# EAGLE design batteryholder2S3P (EAGLE 9.5.1)
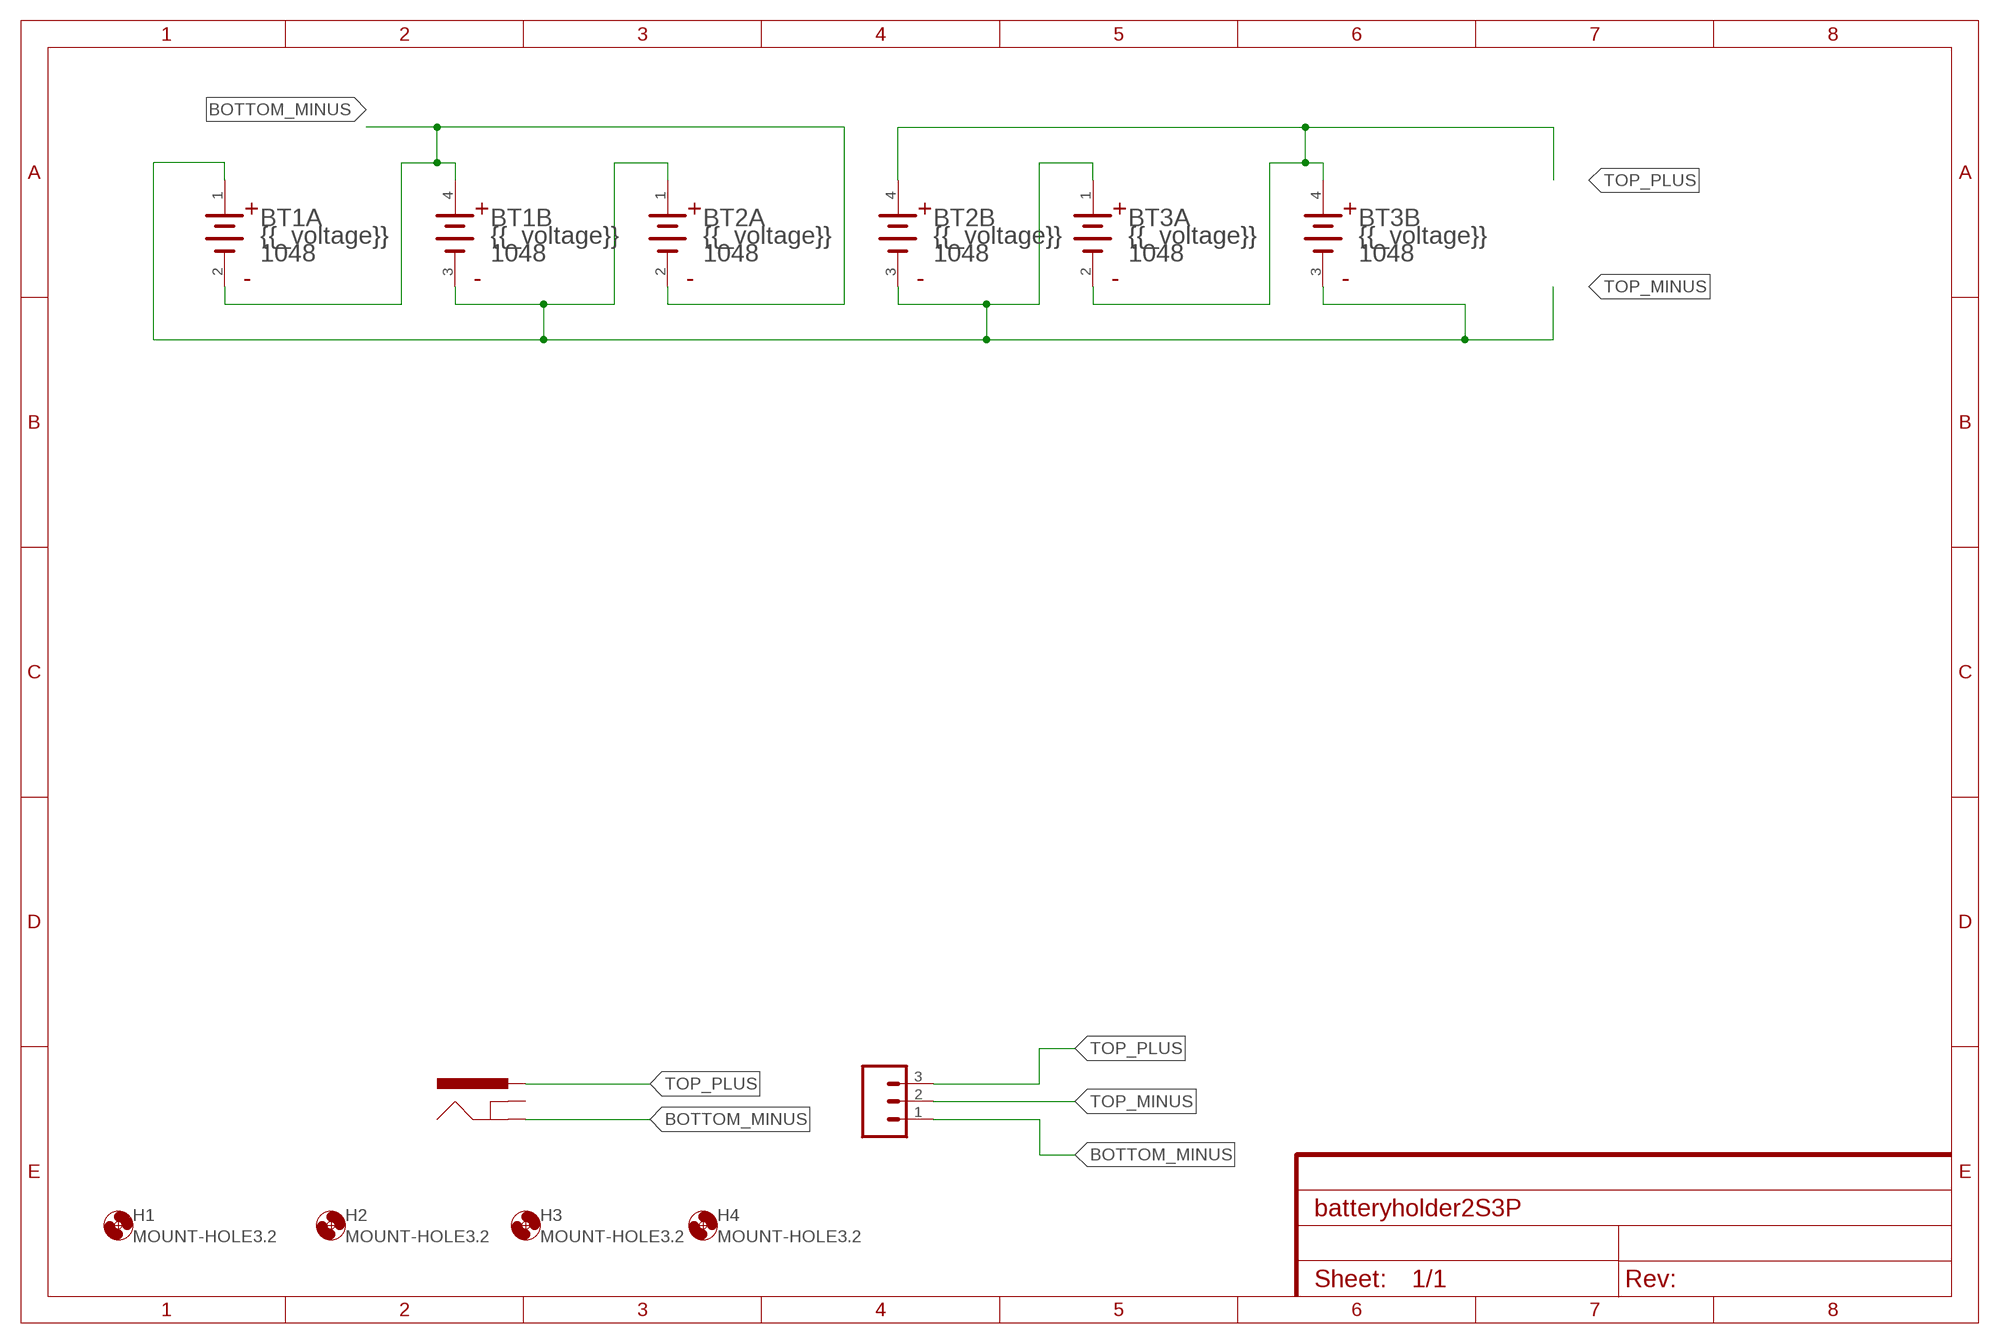
[diagram p0: schematic, sheet 1]

## Parts
BT1  KEYSTONE_1048KEYSTONE_1048_0_0  [KEYSTONE_1048_0]
BT2  KEYSTONE_1048KEYSTONE_1048_0_0  [KEYSTONE_1048_0]
BT3  KEYSTONE_1048KEYSTONE_1048_0_0  [KEYSTONE_1048_0]
H1  MOUNT-HOLE3.2  [3,2]
H2  MOUNT-HOLE3.2  [3,2]
H3  MOUNT-HOLE3.2  [3,2]
H4  MOUNT-HOLE3.2  [3,2]
J1  CONN_03-SCREW-5MM  [SCREWTERMINAL-5MM-3]
J3  5.5x2.1mm Barrel  POWER_JACKSMD  [POWER_JACK_SMD]

## Nets
BOTTOM_MINUS: BT1.2(A:1_CATHODE) BT1.4(B:2_ANODE) BT2.2(A:1_CATHODE) J1.1 J3.P$4(GND)
TOP_MINUS: BT1.1(A:1_ANODE) BT1.3(B:2_CATHODE) BT2.1(A:1_ANODE) BT2.3(B:2_CATHODE) BT3.1(A:1_ANODE) BT3.3(B:2_CATHODE) J1.2
TOP_PLUS: BT2.4(B:2_ANODE) BT3.2(A:1_CATHODE) BT3.4(B:2_ANODE) J1.3 J3.VIN0(PWR)
Unconnected: J3.GND(GNDBREAK)

## Library data of the parts
BT1-BT3 = Keystone - 1048:KEYSTONE_1048: SMT Holder for Dual 18650 Batteries; CENTROID_NOT_SPECIFIED: No; CONN_ORIENTATION: Horizontal; CONTACT_MATERIAL: Gold,Nickel; DATASHEET: https://www.keyelco.com/userAssets/file/M65p27.pdf; DEVICE_CLASS_L1: Connectors; DEVICE_CLASS_L2: unset; DEVICE_CLASS_L3: unset; DIGIKEY_DESCRIPTION: BATT HOLDER 18650 2 CELL SMD TAB; DIGIKEY_PART_NUMBER: 36-1048-ND; FOOTPRINT_URL: https://www.keyelco.com/product-pdf.cfm?p=920; HEIGHT: 0.595inch; LEAD_FREE: yes; MF: Keystone; MFG_PACKAGE_IDENT: 1048; MFG_PACKAGE_IDENT_DATE: 0; MFG_PACKAGE_IDENT_REV: 0; MOUSER_DESCRIPTION: Battery holder SMD Dimensions L x W x H: 86 x 39.78 x 14.86 mm Suitable for: 2 x 18650; MOUSER_PART_NUMBER: 534-1048; MPN: 1048; NUMBER_OF_CONTACTS: 2; PACKAGE: SMT_BTTHLDR_18650_DUAL; PREFIX: BT; ROHS: yes; TEMPERATURE_RANGE_HIGH: +145°C; TEMPERATURE_RANGE_LOW: -50°C; VERIFICATION_VERSION: 0.0.0.1
H1-H4 = holes:MOUNT-HOLE: MOUNTING HOLE with drill center marker
J1 = SparkFun-Connectors:CONN_03: Multi connection point. Often used as Generic Header-pin footprint for 0.1 inch spaced/style header connections On any of the 0.1 inch spaced packages, you can populate with these: Break Away Headers - Straight <https://www.sparkfun.com/products/116> (PRT-00116) Break Away Male Headers - Right Angle <https://www.sparkfun.com/products/553> (PRT-00553) Female Headers <https://www.sparkfun.com/products/115> (PRT-00115) Break Away Headers - Machine Pin <https://www.sparkfun.com/products/117> (PRT-00117) Break Away Female Headers - Swiss Machine Pin <https://www.sparkfun.com/products/743> (PRT-00743) Stackable Header - 3 Pin (Female, 0.1") <https://www.sparkfun.com/products/13875> (PRT-13875) For SCREWTERMINALS and SPRING TERMINALS visit here: Screw Terimnals on SparkFun.com <https://www.sparkfun.com/search/results?term=Screw+Terminals> (5mm/3.5mm/2.54mm spacing) This device is also useful as a general connection point to wire up your design to another part of your project. Our various solder wires solder well into these plated through hole pads. Hook-Up Wire - Assortment (Stranded, 22 AWG) <https://www.sparkfun.com/products/11375> (PRT-11375) Hook-Up Wire - Assortment (Solid Core, 22 AWG) <https://www.sparkfun.com/products/11367> (PRT-11367) View the entire wire category on our website here <https://www.sparkfun.com/categories/141> Special notes: Molex polarized connector foot print use with SKU : PRT-08232 with associated crimp pins and housings.; PROD_ID: CONN-10134; SF_SKU: PRT-08433
J3 = SparkFun-Connectors:POWER_JACK: Power Jack Connector This is the standard 5.5mm barrel jack for power. The PTH is the most common, proven, reliable, footprint. The Slot footprint only works if the mill layer is transmitted to the PCB fab house so be warned. Here are the connectors we sell at SparkFun: DC Barrel Power Jack/Connector <https://www.sparkfun.com/products/119> (PRT-00119) DC Barrel Power Jack/Connector (SMD) <https://www.sparkfun.com/products/12748> (PRT-12748) DC Barrel Jack Adapter - Breadboard Compatible <https://www.sparkfun.com/products/10811> (PRT-10811) It is used on this SparkFun product (and many, many others): SparkFun RedBoard - Programmed with Arduino <https://www.sparkfun.com/products/12757> (DEV-12757) Also, if you need a mating power supply or connector, please check these out: Wall Adapter Power Supply - 9VDC 650mA <https://www.sparkfun.com/products/298> (TOL-00298) DC Barrel Jack Adapter - Male <https://www.sparkfun.com/products/10287> (PRT-10287); PROD_ID: CONN-08106; SF_ID: PRT-12748

## Board
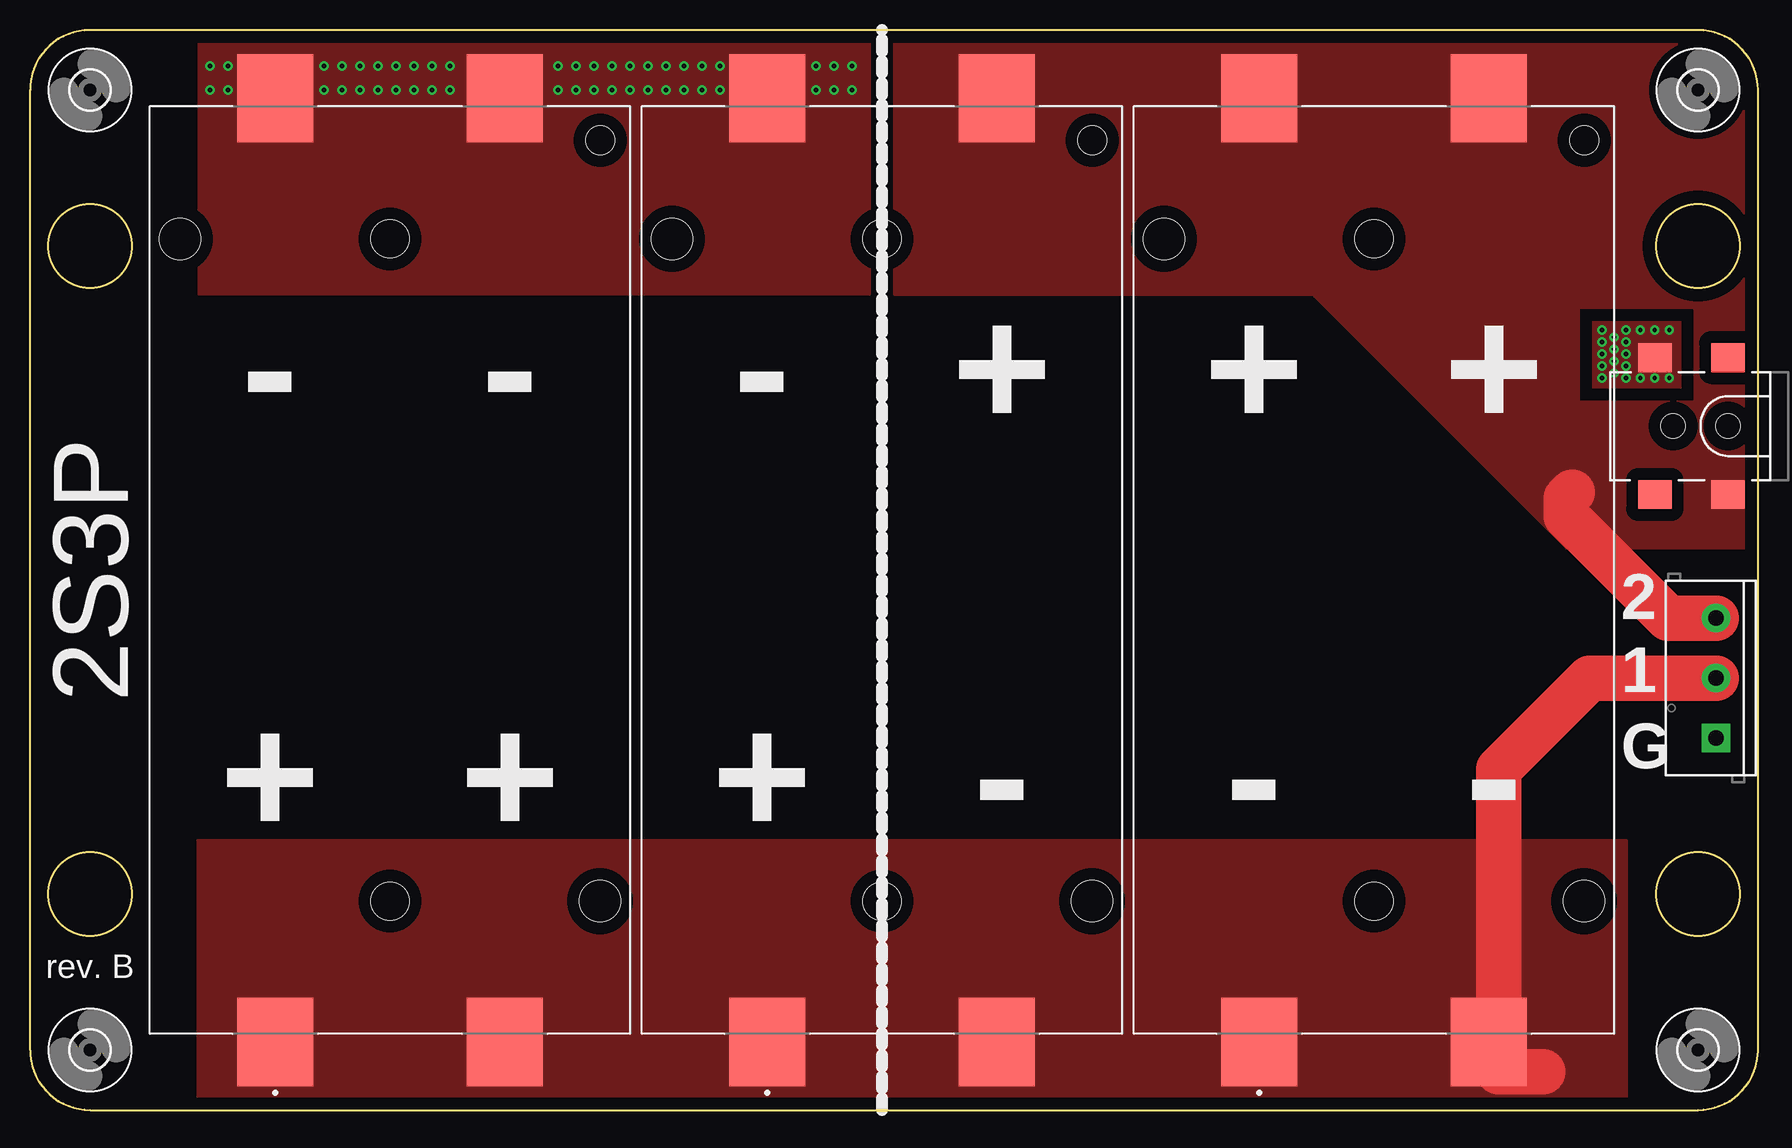
[diagram p1: board, top side]
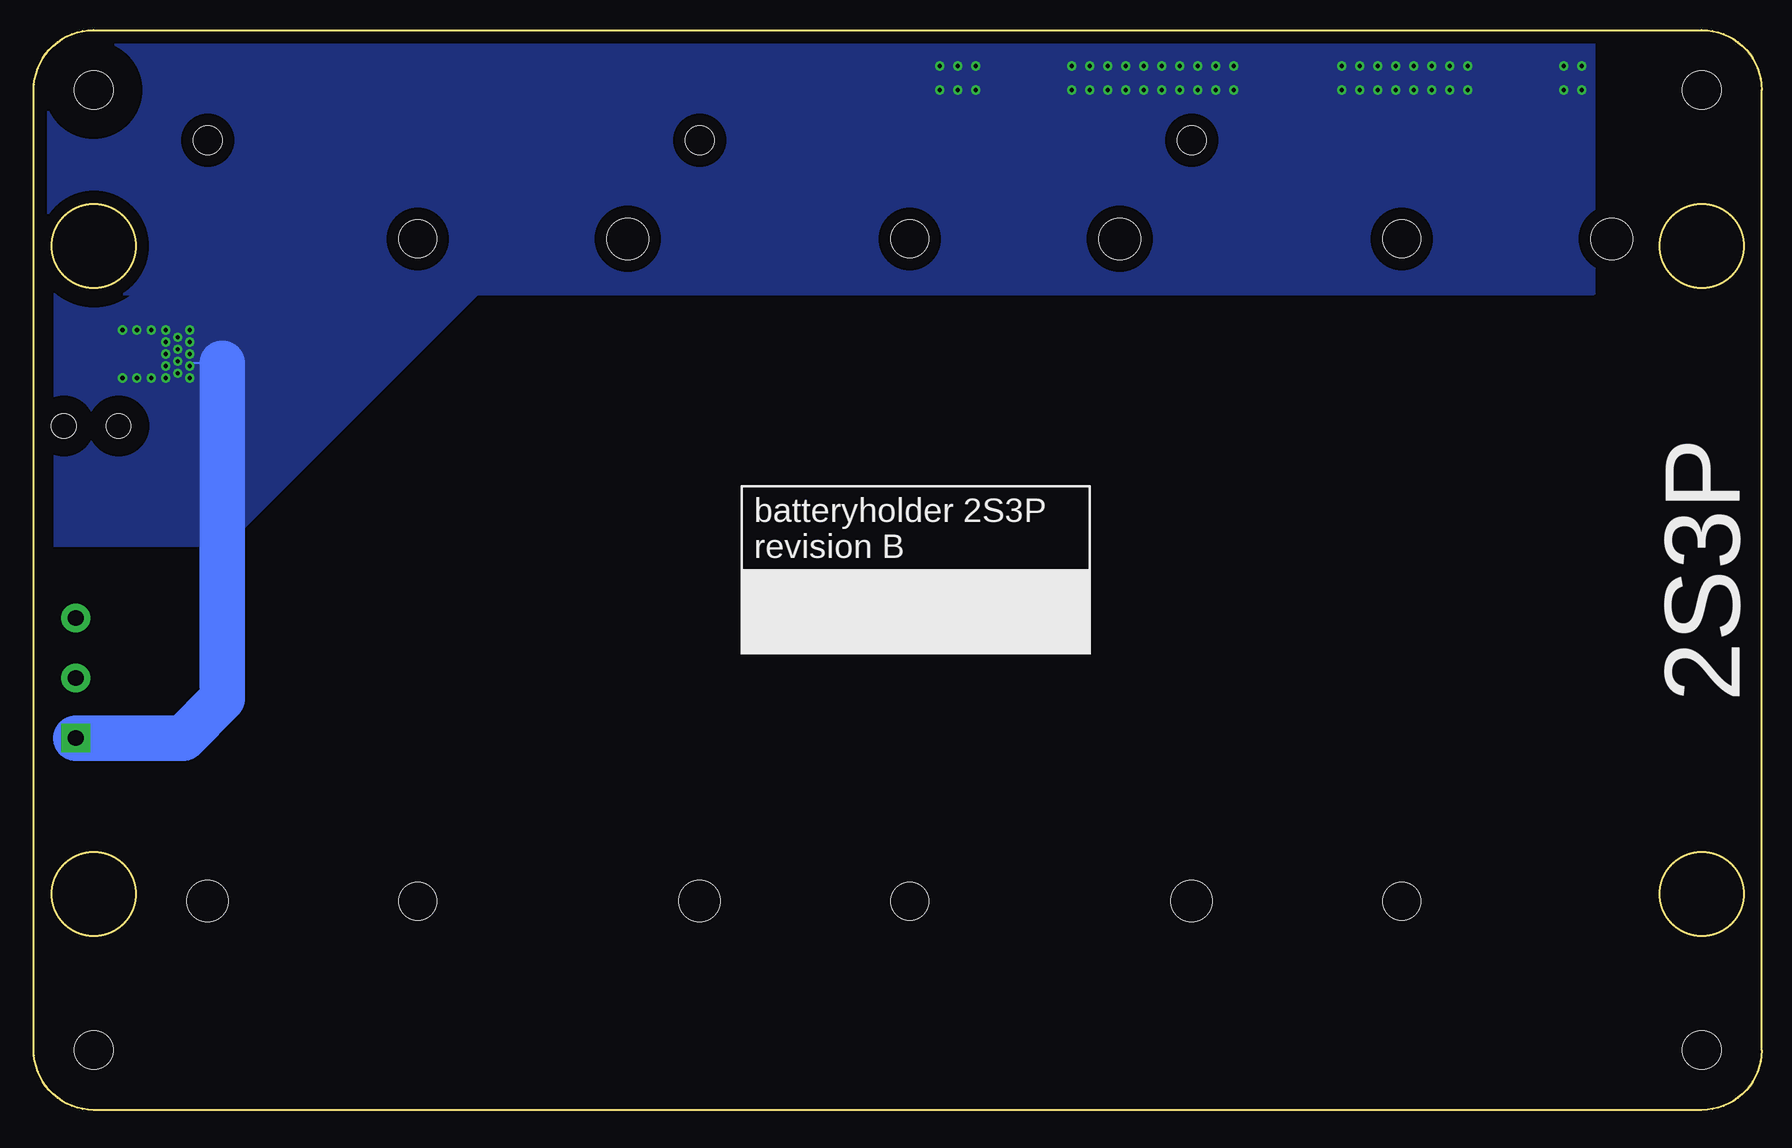
[diagram p2: board, bottom side, seen from below]

Size 144 x 90 mm. Coordinates in mm from the lower left corner, seen from the top.
Outline: 0,76.1 0,5 arc90 5,0 139,0 arc90 144,5 144,85 arc90 139,90 5,90 arc90 0,85 0,76
Outline: circle at 5,18 radius 3.5
Outline: circle at 5,72 radius 3.5
Outline: circle at 139,72 radius 3.5
Outline: circle at 139,18 radius 3.5
Copper layers (1*16): Top 0.035mm / dielectric 1.5mm / Bottom 0.035mm
Design rules "default": minimum track width 6mil, minimum drill 0.35mm, track to track 6mil, track to pad 6mil, pad to pad 6mil, via to via 6mil, smd to smd 6mil, copper to edge 40mil, drill to drill 6mil, minimum pad ring 10mil, minimum via ring 8mil, stop-mask expansion 4mil, vias tented up to drill 0mil, thermal gap 10mil

### Footprints (pad centres in the part's own frame; a part is rotated, then mirrored left to right if it is on the bottom)
KEYSTONE_1048_0 = smd 7.34 x 6.35: 1 -39.33,9.555; 2 39.33,9.555; 3 -39.33,-9.555; 4 39.33,-9.555 | hole 3.45: 27.6,17.505; -27.6,-17.505 | hole 2.39: 35.82,-17.505 | hole 3.17: 27.6,0; -27.6,0
3,2 = hole 3.2: 0,0
SCREWTERMINAL-5MM-3 = drill 1.3 pad 2.413 square: 1 0,0 | drill 1.3 pad 2.413: 2 5,0; 3 10,0
POWER_JACK_SMD = smd 2.8 x 2.4: GND 0,-5.7; P$4 6.1,-5.7; VIN0 0,5.7; VIN1 6.1,5.7 | hole 2.032: 0,0; 4.572,0

### Placement (x,y rotation side)
BT1  30,45 90 top
BT2  71,45 90 top
BT3  112,45 90 top
H1  5,85 0 top
H2  5,5 0 top
H3  139,85 0 top
H4  139,5 0 top
J1  140.5,31 90 top
J3  141.5,57 180 top

### Tracks (layer width: path | path; a pad name or v marks a point on that pad's centre or on a via)
BOTTOM_MINUS  (via drill 0.35)
  Bottom 0.152: 128.27,62.23 130.77,62.23 v131,62
  Bottom 3.81: 128.27,62.23 128.27,34.29 131.56,31 J1.1
  other vias: 15,87 16.5,87 24.5,87 26,87 27.5,87 29,87 30.5,87 32,87 33.5,87 35,87 44,87 45.5,87 47,87 48.5,87 50,87 51.5,87 53,87 54.5,87 56,87 57.5,87 65.5,87 67,87 68.5,87 15,85 16.5,85 24.5,85 26,85 27.5,85 29,85 30.5,85 32,85 33.5,85 35,85 44,85 45.5,85 47,85 48.5,85 50,85 51.5,85 53,85 54.5,85 56,85 57.5,85 65.5,85 67,85 68.5,85 131,64 131,65 131,63 131,61 133,65 133,64 133,63 133,62 133,61 132,64.4 132,63.4 132,62.4 132,61.4 134.2,65 135.4,65 136.6,65 134.2,61 135.4,61 136.6,61
  pour Bottom (no thermals): 14,89 14,68 143,68 143,89
  pour Bottom (isolate 1.524, rank 2, no thermals): 107,88 107,68 128,47 143,47 143,88
  pour Top (no thermals): 14.5,68 70,68 70,89 14,89 14,68
  pour Top (no thermals): 137.6,65.7 130.2,65.7 130.2,60.2 137.6,60.2
TOP_MINUS
  Top 3.81: J1.2 129.98,36 122.38,28.4 122.38,3.18 126.07,3.18
  pour Top (no thermals): 14,1 14,22.5 133,22.5 133,1
TOP_PLUS
  Top 3.81: 128.5,51.5 128,51 128,49.5 136.5,41 J1.3
  pour Top (no thermals): 72,89 72,68 143,68 143,89
  pour Top (isolate 1, rank 2, no thermals): 107,89 107,67.8 128,46.8 143.51,46.8 143.51,89

### Text on the board
tPlace: - | - | - | + | + | + | 2S3P | 2 | 1 | + | + | + | - | - | - | G | rev. B
bPlace: batteryholder 2S3P | revision B | 2S3P